# Altium project PCB_Project1.PrjPCB
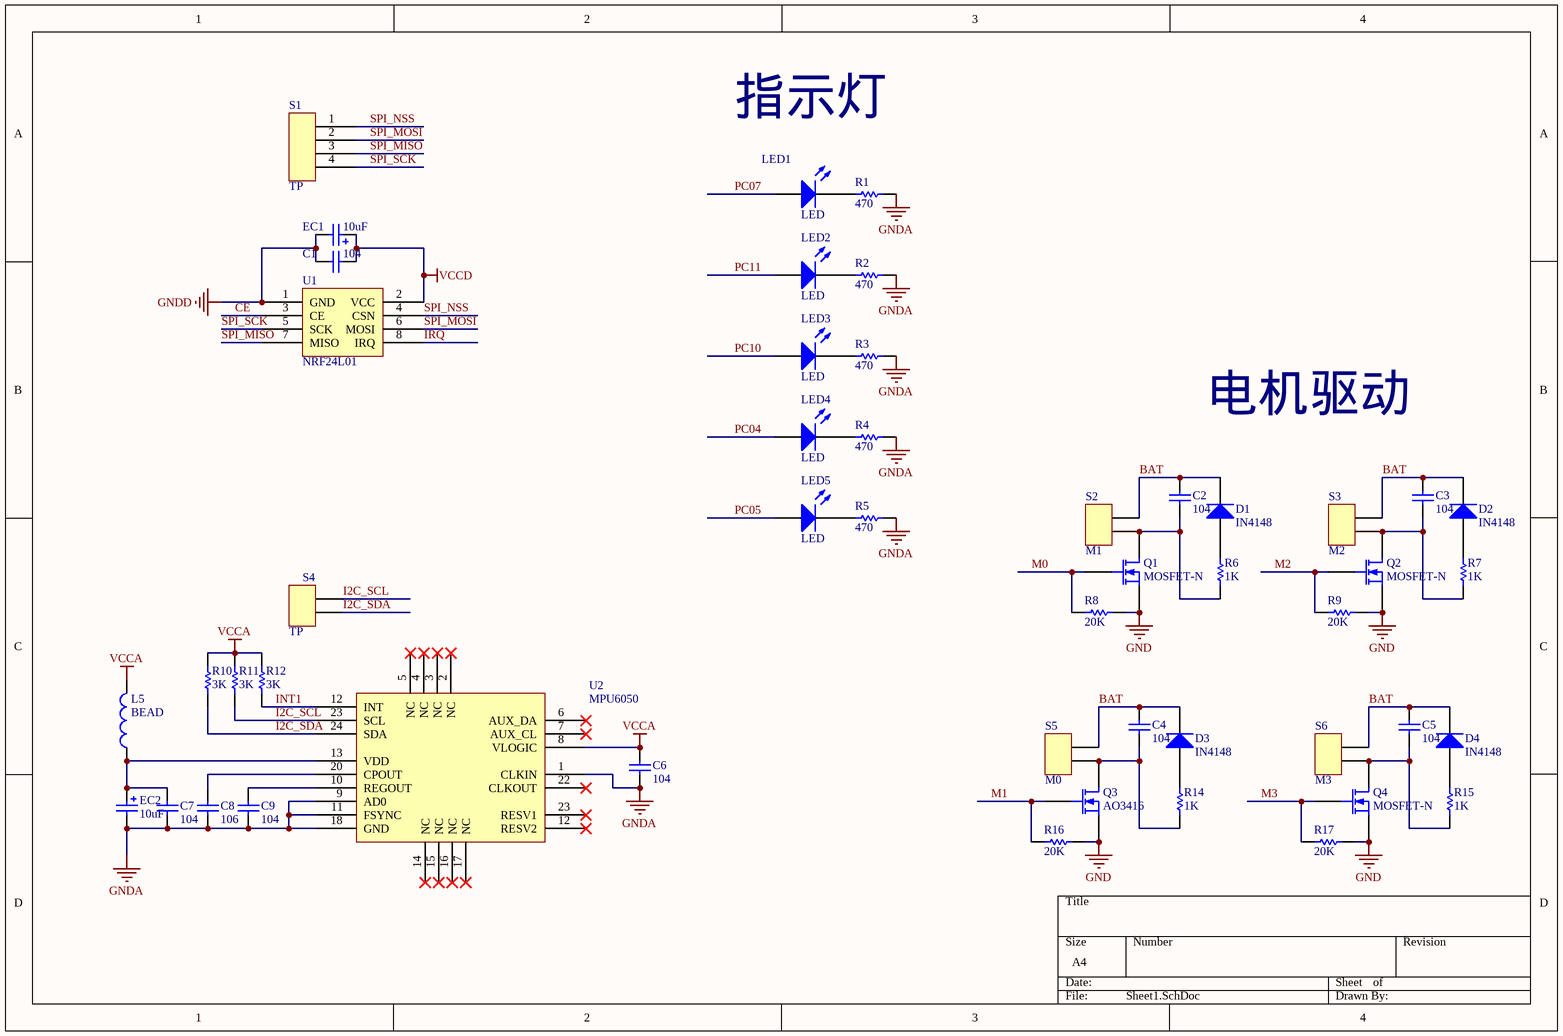
[diagram p0: Sheet1.SchDoc]
3 sheets, 97 parts. Net scope: global (net labels, ports and power ports of the same name join across sheets).
Board file: PCB1.PcbDoc
Sheets:
  Sheet1.SchDoc
  Power.SchDoc
  MUC.SchDoc

## Sheet Sheet1.SchDoc
size A4

### Parts
C1  104  [0603]
C2  104  [0603]
C3  104  [0603]
C4  104  [0603]
C5  104  [0603]
C6  104  [0603]
C7  104  [0603]
C8  106  [0805]
C9  104  [0603]
D1  IN4148  [1206]
D2  IN4148  [1206]
D3  IN4148  [1206]
D4  IN4148  [1206]
EC1  10uF  [1206]
EC2  10uF  [1206]
L5  BEAD  [0603]
LED1  LED  [0805]
LED2  LED  [0805]
LED3  LED  [0805]
LED4  LED  [0805]
LED5  LED  [0805]
Q1  MOSFET-N  [SOT-23_N]
Q2  MOSFET-N  [SOT-23_N]
Q3  AO3416  [SOT-23_N]
Q4  MOSFET-N  [SOT-23_N]
R1  470  [0603]
R2  470  [0603]
R3  470  [0603]
R4  470  [0603]
R5  470  [0603]
R6  1K  [0603]
R7  1K  [0603]
R8  20K  [0603]
R9  20K  [0603]
R10  3K  [0603]
R11  3K  [0603]
R12  3K  [0603]
R14  1K  [0603]
R15  1K  [0603]
R16  20K  [0603]
R17  20K  [0603]
S1  TP  [TP4]
S2  M1  [0805]
S3  M2  [0805]
S4  TP  [TP2]
S5  M0  [0805]
S6  M3  [0805]
U1  NRF24L01  [CN8]
U2  MPU6050  [QFN50P400X400X95_HS-25N]

### Nets
BAT: C2.2 C3.2 C4.2 C5.2 D1.2(K) D2.2(K) D3.2(K) D4.2(K) S2.1 S3.1 S5.1 S6.1
GND: Q1.3(S) Q2.3(S) Q3.3(S) Q4.3(S) R8.2 R9.2 R16.2 R17.2
GNDA: C6.2 C7.1 C8.2 C9.2 EC2.2 R1.2 R2.2 R3.2 R4.2 R5.2 U2.1(CLKIN) U2.9(AD0) U2.11(FSYNC) U2.18(GND)
GNDD: C1.1 EC1.2 U1.1(GND)
VCCA: C6.1 L5.2 R10.2 R11.2 R12.2 U2.8(VLOGIC)
VCCD: C1.2 EC1.1 U1.2(VCC)
CE: U1.3(CE)
I2C_SCL: R11.1 S4.1 U2.23(SCL)
I2C_SDA: R10.1 S4.2 U2.24(SDA)
INT1: R12.1 U2.12(INT)
IRQ: U1.8(IRQ)
M0: Q1.2(G) R8.1
M1: Q3.2(G) R16.1
M2: Q2.2(G) R9.1
M3: Q4.2(G) R17.1
PC04: LED4.1(A)
PC05: LED5.1(A)
PC07: LED1.1(A)
PC10: LED3.1(A)
PC11: LED2.1(A)
SPI_MISO: S1.3 U1.7(MISO)  [project net PA06]
SPI_MOSI: S1.2 U1.6(MOSI)  [project net PA07]
SPI_NSS: S1.1 U1.4(CSN)  [project net PA04]
SPI_SCK: S1.4 U1.5(SCK)  [project net PA05]
NetC2_1: C2.1 Q1.1(D) R6.1 S2.2
NetC3_1: C3.1 Q2.1(D) R7.1 S3.2
NetC4_1: C4.1 Q3.1(D) R14.1 S5.2
NetC5_1: C5.1 Q4.1(D) R15.1 S6.2
NetC7_2: C7.2 EC2.1 L5.1 U2.13(VDD)
NetC8_1: C8.1 U2.20(CPOUT)
NetC9_1: C9.1 U2.10(REGOUT)
NetD1_1: D1.1(A) R6.2
NetD2_1: D2.1(A) R7.2
NetD3_1: D3.1(A) R14.2
NetD4_1: D4.1(A) R15.2
NetLED1_2: LED1.2(K) R1.1
NetLED2_2: LED2.2(K) R2.1
NetLED3_2: LED3.2(K) R3.1
NetLED4_2: LED4.2(K) R4.1
NetLED5_2: LED5.2(K) R5.1

Not connected (* = marked no-connect by the designer): U2 2(NC)* 3(NC)* 4(NC)* 5(NC)* 6(AUX_DA)* 7(AUX_CL)* 14(NC)* 15(NC)* 16(NC)* 17(NC)* 22(CLKOUT)*

### Notes on the sheet
- 指示灯
- 电机驱动

### Library data of the parts
C1-C9 = CAP
D1-D4 = DIODE
EC1 EC2 = EC
L5 = Inductor: Code_IEC: 1005; Published: 8-Jun-2000; LatestRevisionDate: 29-May-2009; LatestRevisionNote: IPC-7351 Footprint Added.; PackageReference: 0402-A; Publisher: Altium Limited; PackageDescription: Chip Inductor; Code_JEITA: 0402
Q1-Q4 = MOSFET-N: N-Channel MOSFET; Published: 8-Jun-2000; LatestRevisionDate: 17-Jul-2002; LatestRevisionNote: Re-released for DXP Platform.; PackageVersion: 1995/1996; PackageReference: E3; Publisher: Altium Limited; PackageDescription: TO, Flat Index; 3 In-Line, Axial Leads; Body Dia. 4.6mm; Lead Dia. 0.5 mm (max)
R1-R12 R14-R17 = RES
S1 = CON4
S2-S6 = CON2

## Sheet Power.SchDoc
size A4
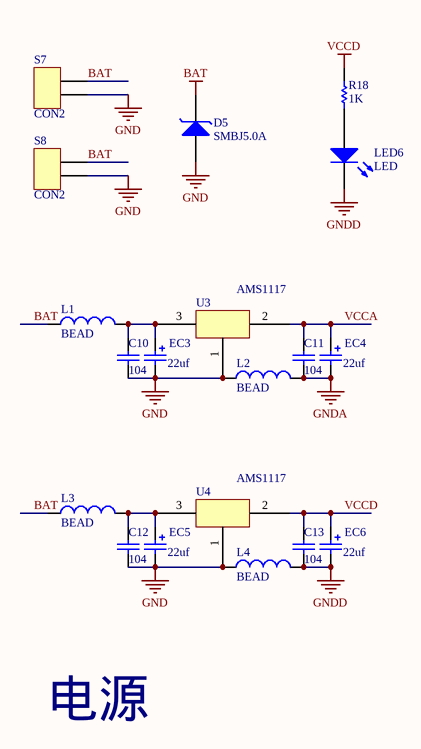
[diagram p1: Power.SchDoc]

### Parts
C10  104  [0603]
C11  104  [0603]
C12  104  [0603]
C13  104  [0603]
D5  SMBJ5.0A  [DIOM4436X23N]
EC3  22uf  [1206]
EC4  22uf  [1206]
EC5  22uf  [1206]
EC6  22uf  [1206]
L1  BEAD  [0805]
L2  BEAD  [0805]
L3  BEAD  [0805]
L4  BEAD  [0805]
LED6  LED  [0805]
R18  1K  [0603]
S7  CON2  [SIP2]
S8  CON2  [1206]
U3  AMS1117  [SOT223]
U4  AMS1117  [SOT223]

### Nets
BAT: D5.2(K) L1.1 L3.1 S7.1 S8.1
GND: C10.2 C12.2 D5.1(A) EC3.2 EC5.2 L2.1 L4.1 S7.2 S8.2 U3.1 U4.1
GNDA: C11.2 EC4.2 L2.2
GNDD: C13.2 EC6.2 L4.2 LED6.2(K)
VCCA: C11.1 EC4.1 U3.2
VCCD: C13.1 EC6.1 R18.1 U4.2
NetC10_1: C10.1 EC3.1 L1.2 U3.3
NetC12_1: C12.1 EC5.1 L3.2 U4.3
NetLED6_1: LED6.1(A) R18.2

Not connected (* = marked no-connect by the designer): U3 4; U4 4

### Notes on the sheet
- 电源

### Library data of the parts
C10-C13 = CAP
EC3-EC6 = EC
L1-L4 = Inductor: Code_IEC: 1005; Published: 8-Jun-2000; LatestRevisionDate: 29-May-2009; LatestRevisionNote: IPC-7351 Footprint Added.; PackageReference: 0402-A; Publisher: Altium Limited; PackageDescription: Chip Inductor; Code_JEITA: 0402
R18 = RES

## Sheet MUC.SchDoc
size A4
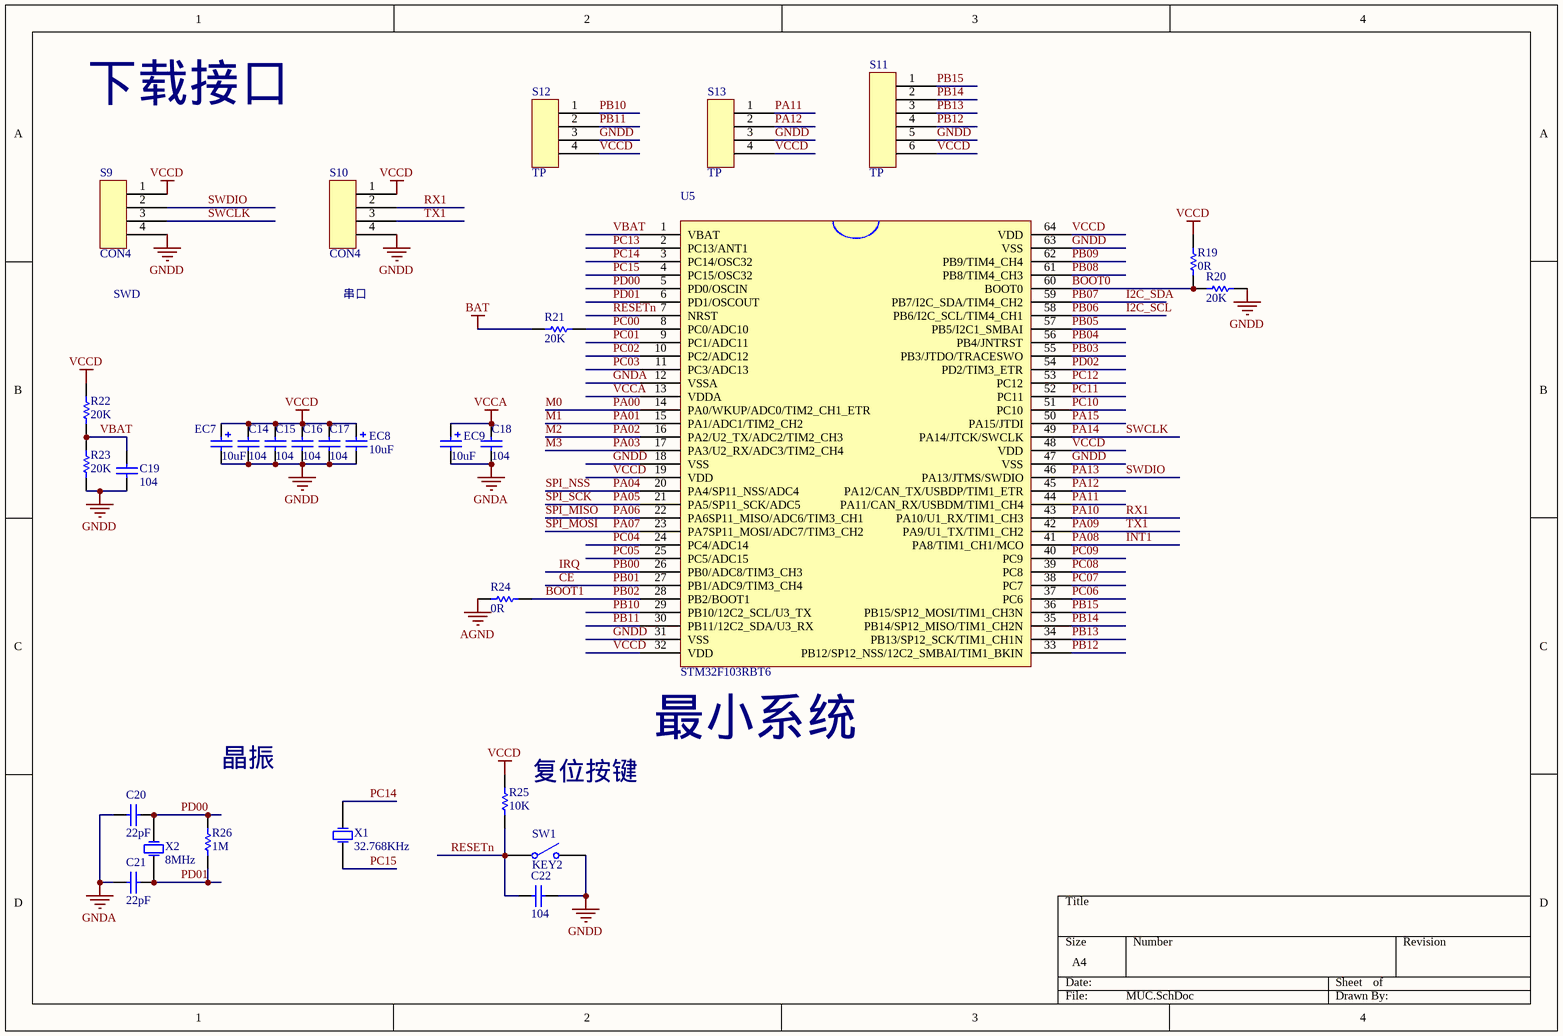
[diagram p2: MUC.SchDoc]

### Parts
C14  104  [0603]
C15  104  [0603]
C16  104  [0603]
C17  104  [0603]
C18  104  [0603]
C19  104  [0603]
C20  22pF  [0805]
C21  22pF  [0805]
C22  104  [0603]
EC7  10uF  [1206]
EC8  10uF  [1206]
EC9  10uF  [1206]
R19  0R  [0603]
R20  20K  [0603]
R21  20K  [0603]
R22  20K  [0603]
R23  20K  [0603]
R24  0R  [0603]
R25  10K  [0603]
R26  1M  [0805]
S9  CON4  [SIP4]
S10  CON4  [SIP4]
S11  TP  [TP6]
S12  TP  [TP4]
S13  TP  [TP4]
SW1  KEY2  [SSOP2N]
U5  STM32F103RBT6  [TSQFP50P1200X1200X160-64N]
X1  32.768KHz  [XTAL-50-2]
X2  8MHz  [XTAL-200]

### Nets
AGND: R24.1
BAT: R21.1
GNDA: C18.1 C20.1 C21.1 EC9.2 U5.12(VSSA)
GNDD: C14.1 C15.1 C16.1 C17.1 C19.1 C22.2 EC7.2 EC8.2 R20.2 R23.1 S9.4 S10.4 S11.5 S12.3 S13.3 SW1.2(NO1) U5.18(VSS) U5.31(VSS) U5.47(VSS) U5.63(VSS)
VCCA: C18.2 EC9.1 U5.13(VDDA)
VCCD: C14.2 C15.2 C16.2 C17.2 EC7.1 EC8.1 R19.2 R22.2 R25.2 S9.1 S10.1 S11.6 S12.4 S13.4 U5.19(VDD) U5.32(VDD) U5.48(VDD) U5.64(VDD)
BOOT0: R19.1 R20.1 U5.60(BOOT0)
BOOT1: R24.2 U5.28(PB2/BOOT1)  [also labelled PB02]
CE: U5.27(PB1/ADC9/TIM3_CH4)  [also labelled PB01]
I2C_SCL: U5.58(PB6/I2C_SCL/TIM4_CH1)  [also labelled PB06]
I2C_SDA: U5.59(PB7/I2C_SDA/TIM4_CH2)  [also labelled PB07]
INT1: U5.41(PA8/TIM1_CH1/MCO)  [also labelled PA08]
IRQ: U5.26(PB0/ADC8/TIM3_CH3)  [also labelled PB00]
M0: U5.14(PA0/WKUP/ADC0/TIM2_CH1_ETR)  [also labelled PA00]
M1: U5.15(PA1/ADC1/TIM2_CH2)  [also labelled PA01]
M2: U5.16(PA2/U2_TX/ADC2/TIM2_CH3)  [also labelled PA02]
M3: U5.17(PA3/U2_RX/ADC3/TIM2_CH4)  [also labelled PA03]
PA04: U5.20(PA4/SP11_NSS/ADC4)  [also labelled SPI_NSS]
PA05: U5.21(PA5/SP11_SCK/ADC5)  [also labelled SPI_SCK]
PA06: U5.22(PA6SP11_MISO/ADC6/TIM3_CH1)  [also labelled SPI_MISO]
PA07: U5.23(PA7SP11_MOSI/ADC7/TIM3_CH2)  [also labelled SPI_MOSI]
PA09: S10.3 U5.42(PA9/U1_TX/TIM1_CH2)  [also labelled TX1]
PA10: S10.2 U5.43(PA10/U1_RX/TIM1_CH3)  [also labelled RX1]
PA11: S13.1 U5.44(PA11/CAN_RX/USBDM/TIM1_CH4)
PA12: S13.2 U5.45(PA12/CAN_TX/USBDP/TIM1_ETR)
PA13: S9.2 U5.46(PA13/JTMS/SWDIO)  [also labelled SWDIO]
PA14: S9.3 U5.49(PA14/JTCK/SWCLK)  [also labelled SWCLK]
PA15: U5.50(PA15/JTDI)
PB03: U5.55(PB3/JTDO/TRACESWO)
PB04: U5.56(PB4/JNTRST)
PB05: U5.57(PB5/I2C1_SMBAI)
PB08: U5.61(PB8/TIM4_CH3)
PB09: U5.62(PB9/TIM4_CH4)
PB10: S12.1 U5.29(PB10/12C2_SCL/U3_TX)
PB11: S12.2 U5.30(PB11/12C2_SDA/U3_RX)
PB12: S11.4 U5.33(PB12/SP12_NSS/12C2_SMBAI/TIM1_BKIN)
PB13: S11.3 U5.34(PB13/SP12_SCK/TIM1_CH1N)
PB14: S11.2 U5.35(PB14/SP12_MISO/TIM1_CH2N)
PB15: S11.1 U5.36(PB15/SP12_MOSI/TIM1_CH3N)
PC00: R21.2 U5.8(PC0/ADC10)
PC01: U5.9(PC1/ADC11)
PC02: U5.10(PC2/ADC12)
PC03: U5.11(PC3/ADC13)
PC04: U5.24(PC4/ADC14)
PC05: U5.25(PC5/ADC15)
PC06: U5.37(PC6)
PC07: U5.38(PC7)
PC08: U5.39(PC8)
PC09: U5.40(PC9)
PC10: U5.51(PC10)
PC11: U5.52(PC11)
PC12: U5.53(PC12)
PC13: U5.2(PC13/ANT1)
PC14: U5.3(PC14/OSC32) X1.2(OSC2)
PC15: U5.4(PC15/OSC32) X1.1(OSC1)
PD00: C20.2 R26.2 U5.5(PD0/OSCIN) X2.2(OSC2)
PD01: C21.2 R26.1 U5.6(PD1/OSCOUT) X2.1(OSC1)
PD02: U5.54(PD2/TIM3_ETR)
RESETn: C22.1 R25.1 SW1.1(COMMON1) U5.7(NRST)
VBAT: C19.2 R22.1 R23.2 U5.1(VBAT)

### Notes on the sheet
- 下载接口
- SWD
- 串口
- 晶振
- (near R25) 复位按键
- (near U5) 最小系统

### Library data of the parts
C14-C22 = CAP
EC7-EC9 = EC
R19-R26 = RES
S11 = CON6
S12 S13 = CON4
X1 X2 = XTAL

## Nets that join several sheets
BAT: Sheet1 (12 pins), Power (5 pins), MUC (R21.1)
GND: Sheet1 (8 pins), Power (11 pins)
GNDA: Sheet1 (14 pins), Power (C11.2 EC4.2 L2.2), MUC (5 pins)
GNDD: Sheet1 (C1.1 EC1.2 U1.1), Power (C13.2 EC6.2 L4.2 LED6.2), MUC (20 pins)
VCCA: Sheet1 (6 pins), Power (C11.1 EC4.1 U3.2), MUC (C18.2 EC9.1 U5.13)
VCCD: Sheet1 (C1.2 EC1.1 U1.2), Power (C13.1 EC6.1 R18.1 U4.2), MUC (18 pins)
CE: Sheet1 (U1.3), MUC (U5.27)
I2C_SCL: Sheet1 (R11.1 S4.1 U2.23), MUC (U5.58)
I2C_SDA: Sheet1 (R10.1 S4.2 U2.24), MUC (U5.59)
INT1: Sheet1 (R12.1 U2.12), MUC (U5.41)
IRQ: Sheet1 (U1.8), MUC (U5.26)
M0: Sheet1 (Q1.2 R8.1), MUC (U5.14)
M1: Sheet1 (Q3.2 R16.1), MUC (U5.15)
M2: Sheet1 (Q2.2 R9.1), MUC (U5.16)
M3: Sheet1 (Q4.2 R17.1), MUC (U5.17)
PA04: Sheet1 (S1.1 U1.4), MUC (U5.20)
PA05: Sheet1 (S1.4 U1.5), MUC (U5.21)
PA06: Sheet1 (S1.3 U1.7), MUC (U5.22)
PA07: Sheet1 (S1.2 U1.6), MUC (U5.23)
PC04: Sheet1 (LED4.1), MUC (U5.24)
PC05: Sheet1 (LED5.1), MUC (U5.25)
PC07: Sheet1 (LED1.1), MUC (U5.38)
PC10: Sheet1 (LED3.1), MUC (U5.51)
PC11: Sheet1 (LED2.1), MUC (U5.52)